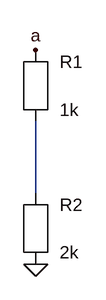
[diagram p0: schematic two_instance_wire.asc]
two_instance_wire.asc, the LTspice schematic file:
Version 4
SHEET 1 880 680
WIRE 96 192 96 288
SYMBOL res 96 144 R0
SYMATTR InstName R1
SYMATTR Value 1k
SYMBOL res 96 336 R0
SYMATTR InstName R2
SYMATTR Value 2k
FLAG 96 96 a
FLAG 96 384 0

The netlist it stands for:
* two_instance_wire.asc
R1 a N001 1k
R2 N001 0 2k
.backanno
.end